# EAGLE schematic P1 Breakout (EAGLE 9.0.1)
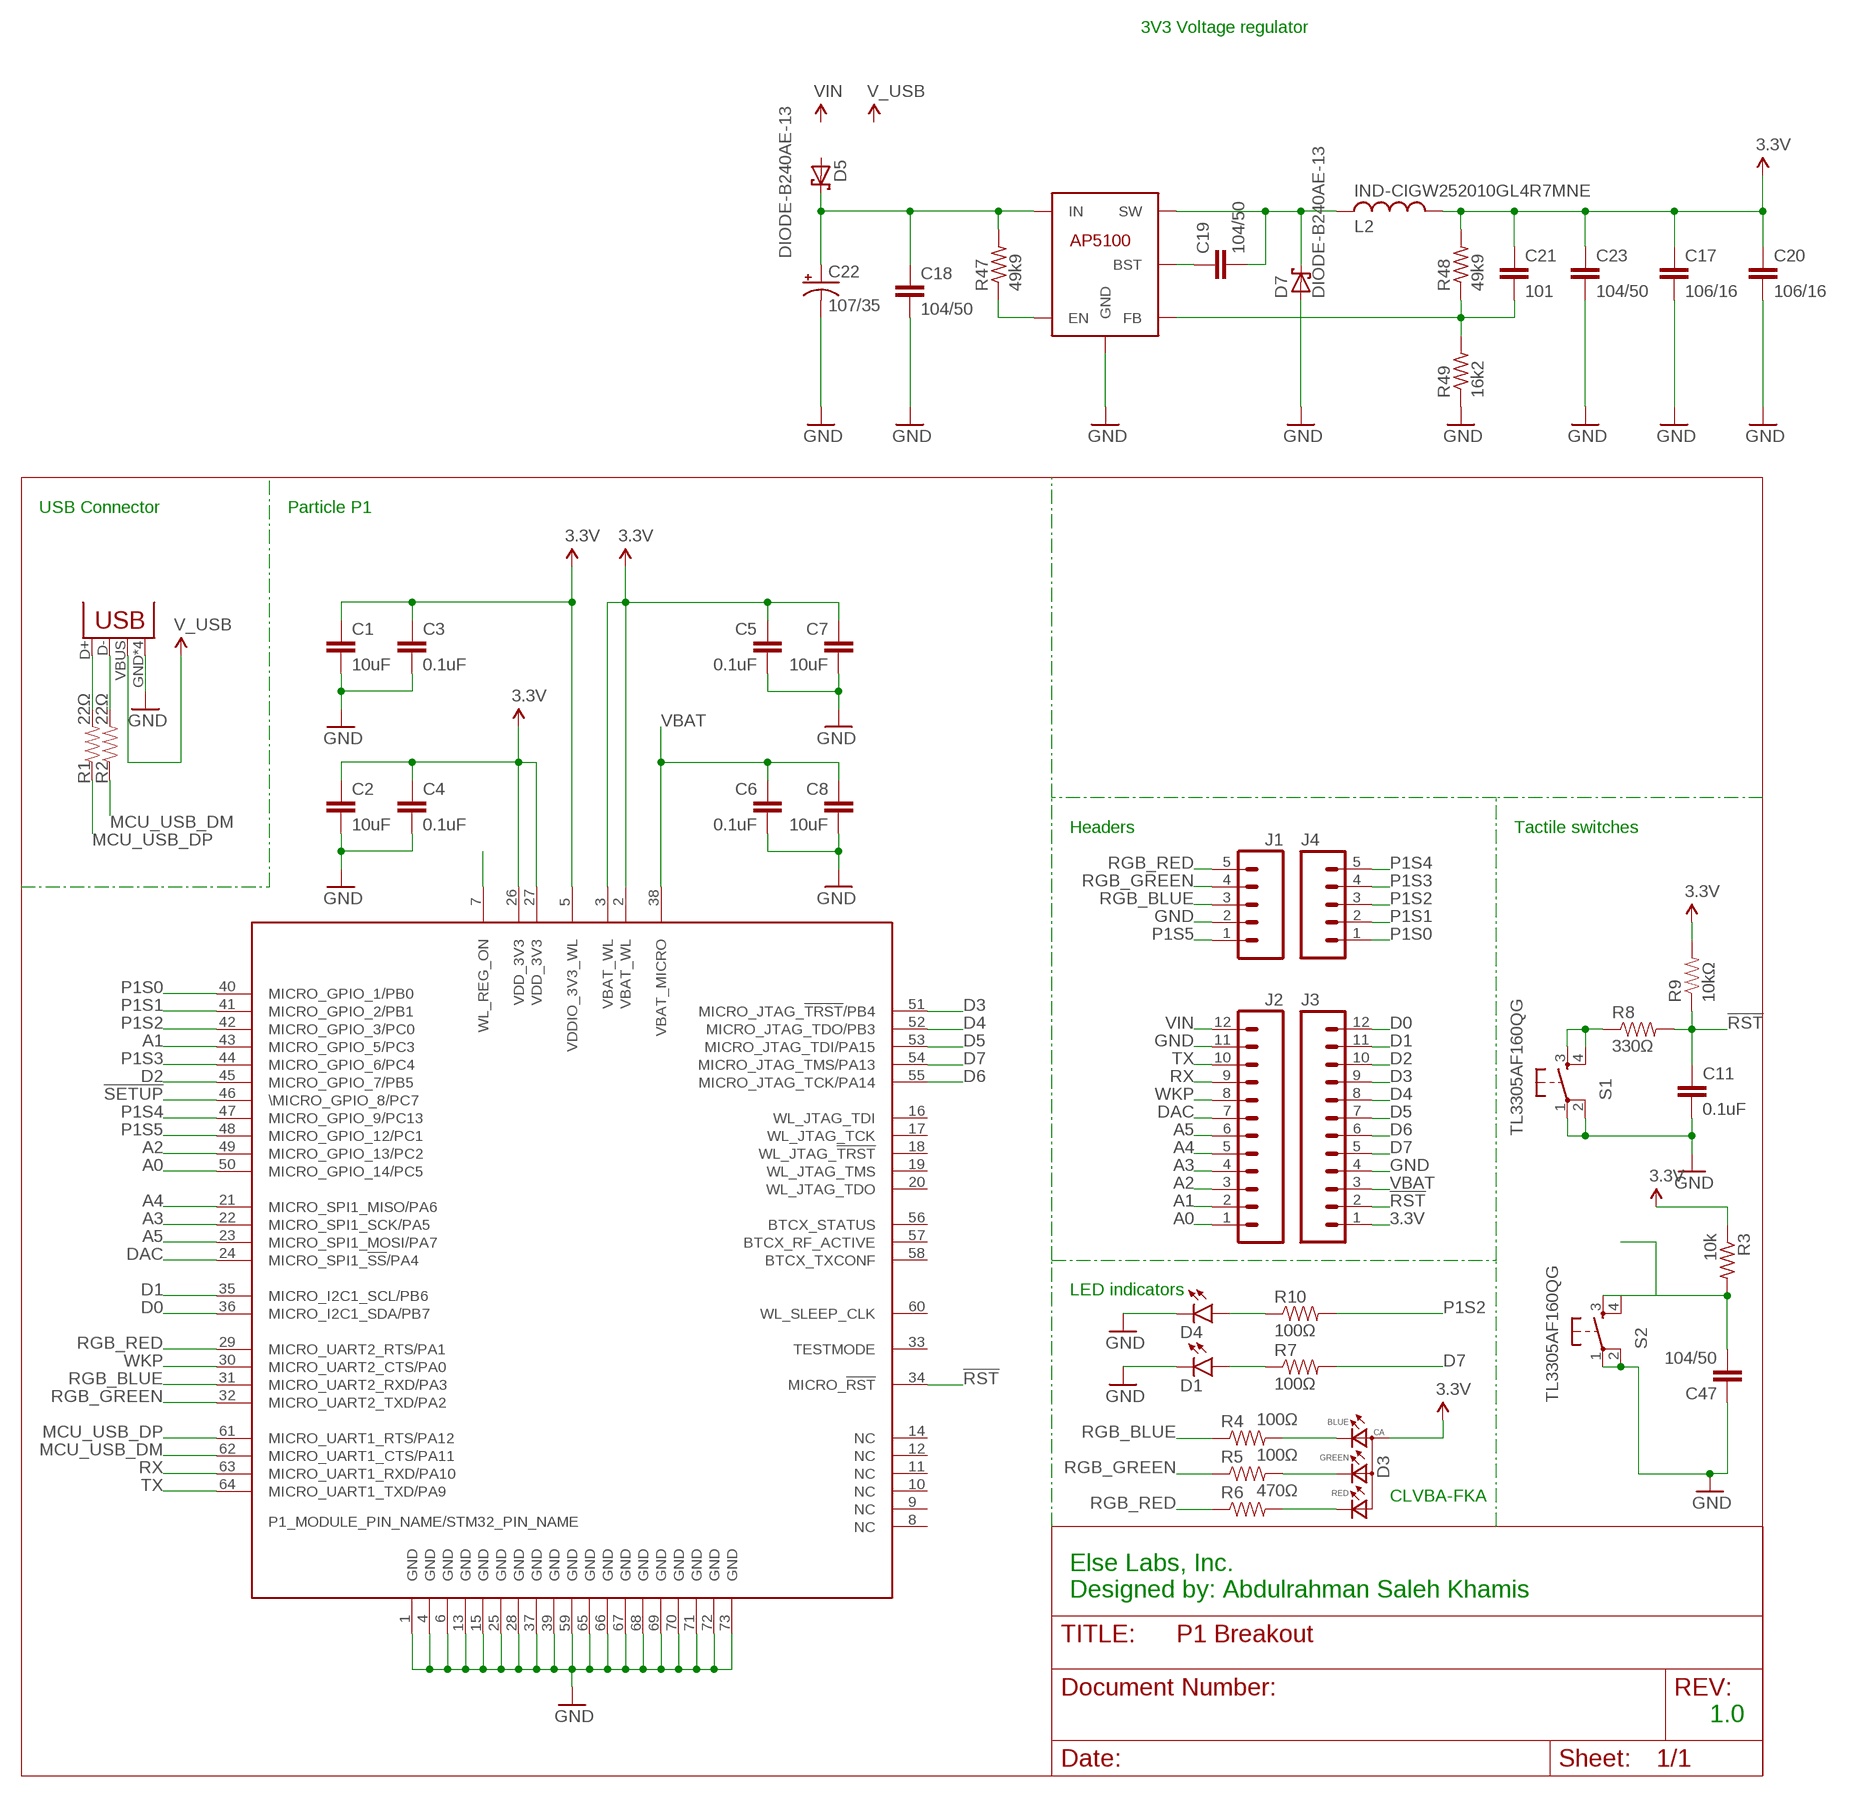
[diagram p0: schematic, sheet 1]

## Parts
C1  10uF  CAP0805  [0805]
C2  10uF  CAP0805  [0805]
C3  0.1uF  CAP0805  [0805]
C4  0.1uF  CAP0805  [0805]
C5  0.1uF  CAP0805  [0805]
C6  0.1uF  CAP0805  [0805]
C7  10uF  CAP0805  [0805]
C8  10uF  CAP0805  [0805]
C11  0.1uF  CAP0805  [0805]
C17  106/16  C-EUC0805  [C0805]
C18  104/50  C-EUC0603  [C0603]
C19  104/50  C-EUC0603  [C0603]
C20  106/16  C-EUC0805  [C0805]
C21  101  C-EUC0603  [C0603]
C22  107/35  CPOL-USUD-6,3X7,7  [UD-6,3X7,7_NICHICON]
C23  104/50  C-EUC0603  [C0603]
C47  104/50  C-EUC0603  [C0603]
D1  LED0603  [LED-0603]
D3  CLVBA-FKAPLCC  [4-PLCC]
D4  LED0603  [LED-0603]
D5  DIODE-B240AE-13  [DO-214AC]
D7  DIODE-B240AE-13  [DO-214AC]
IC5  SMSP-BUCK-AP5100  [SOT23-6]
J1  M05NO_SILK  [1X05_NO_SILK]
J2  M12NO_SILK  [1X12_NO_SILK]
J3  M12NO_SILK  [1X12_NO_SILK]
J4  M05NO_SILK  [1X05_NO_SILK]
JP1  USBUSB-MICROB-SLOT-HOLE  [USB-MICROB-SLOT-HOLE]
L2  IND-CIGW252010GL4R7MNE  [L2520]
R1  22Ω  RESISTOR0805-RES  [0805]
R2  22Ω  RESISTOR0805-RES  [0805]
R3  10k  R-US_R0603  [R0603]
R4  100Ω  RESISTOR0805-RES  [0805]
R5  100Ω  RESISTOR0805-RES  [0805]
R6  470Ω  RESISTOR0805-RES  [0805]
R7  100Ω  RESISTOR0805-RES  [0805]
R8  330Ω  RESISTOR0805-RES  [0805]
R9  10kΩ  RESISTOR0805-RES  [0805]
R10  100Ω  RESISTOR0805-RES  [0805]
R47  49k9  R-US_R0603  [R0603]
R48  49k9  R-US_R0603  [R0603]
R49  16k2  R-US_R0603  [R0603]
S1  TL3305AF160QG  SWITCH-MOMENTARY-4.5MX4.5M  [TACTILE_SWITCH_SMD_4.5X4.5MM]
S2  TL3305AF160QG  SWITCH-MOMENTARY-4.5MX4.5M  [TACTILE_SWITCH_SMD_4.5X4.5MM]
UC1  P1  [WM-N-BM-14]

## Nets
3.3V: C1.1 C2.1 C3.1 C4.1 C5.1 C7.1 C17.1 C20.1 C21.1 C23.1 D3.2(ANODE) J3.1 L2.P$1 R3.1 R9.2 R48.2 UC1.2(VBAT_WL) UC1.3(VBAT_WL) UC1.5(VDDIO_3V3_WL) UC1.26(VDD_3V3) UC1.27(VDD_3V3)
!RST: C11.1 J3.2 R8.2 R9.1 UC1.34(MICRO_!RST!)
!SETUP: UC1.46(\MICRO_GPIO_8/PC7)
A0: J2.1 UC1.50(MICRO_GPIO_14/PC5)
A1: J2.2 UC1.43(MICRO_GPIO_5/PC3)
A2: J2.3 UC1.49(MICRO_GPIO_13/PC2)
A3: J2.4 UC1.22(MICRO_SPI1_SCK/PA5)
A4: J2.5 UC1.21(MICRO_SPI1_MISO/PA6)
A5: J2.6 UC1.23(MICRO_SPI1_MOSI/PA7)
BLR: D3.3(BLUE) R4.2
D0: J3.12 UC1.36(MICRO_I2C1_SDA/PB7)
D1: J3.11 UC1.35(MICRO_I2C1_SCL/PB6)
D2: J3.10 UC1.45(MICRO_GPIO_7/PB5)
D3: J3.9 UC1.51(MICRO_JTAG_!TRST!/PB4)
D4: J3.8 UC1.52(MICRO_JTAG_TDO/PB3)
D5: J3.7 UC1.53(MICRO_JTAG_TDI/PA15)
D6: J3.6 UC1.55(MICRO_JTAG_TCK/PA14)
D7: J3.5 R7.2 UC1.54(MICRO_JTAG_TMS/PA13)
DAC: J2.7 UC1.24(MICRO_SPI1_!SS!/PA4)
GND: C1.2 C2.2 C3.2 C4.2 C5.2 C6.2 C7.2 C8.2 C11.2 C17.2 C18.2 C20.2 C22.- C23.2 C47.1 D1.C D4.C D7.A IC5.2(GND) J1.2 J2.11 J3.4 JP1.GND JP1.P$1(GND) JP1.P$2(GND) JP1.P$3(GND) R49.1 S1.1 S1.2 S2.1 S2.2 UC1.1(GND) UC1.4(GND) UC1.6(GND) UC1.13(GND) UC1.15(GND) UC1.25(GND) UC1.28(GND) UC1.37(GND) UC1.39(GND) UC1.59(GND) UC1.65(GND) UC1.66(GND) UC1.67(GND) UC1.68(GND) UC1.69(GND) UC1.70(GND) UC1.71(GND) UC1.72(GND) UC1.73(GND)
GRR: D3.4(GREEN) R5.2
MCU_USB_DM: R2.1 UC1.62(MICRO_UART1_CTS/PA11)
MCU_USB_DP: R1.1 UC1.61(MICRO_UART1_RTS/PA12)
N$2: JP1.D+ R1.2
N$3: JP1.D- R2.2
N$4: C47.2 R3.2 S2.3
N$6: D1.A R7.1
N$7: R8.1 S1.3 S1.4
N$9: D4.A R10.1
N$15: C18.1 C22.+ D5.C IC5.5(IN) R47.2
N$18: IC5.4(EN) R47.1
N$36: C19.1 IC5.1(BST)
N$37: C19.2 D7.C IC5.6(SW) L2.P$2
N$38: C21.2 IC5.3(FB) R48.1 R49.2
N$43: UC1.7(WL_REG_ON)
P1S0: J4.1 UC1.40(MICRO_GPIO_1/PB0)
P1S1: J4.2 UC1.41(MICRO_GPIO_2/PB1)
P1S2: J4.3 R10.2 UC1.42(MICRO_GPIO_3/PC0)
P1S3: J4.4 UC1.44(MICRO_GPIO_6/PC4)
P1S4: J4.5 UC1.47(MICRO_GPIO_9/PC13)
P1S5: J1.1 UC1.48(MICRO_GPIO_12/PC1)
RER: D3.1(RED) R6.2
RGB_BLUE: J1.3 R4.1 UC1.31(MICRO_UART2_RXD/PA3)
RGB_GREEN: J1.4 R5.1 UC1.32(MICRO_UART2_TXD/PA2)
RGB_RED: J1.5 R6.1 UC1.29(MICRO_UART2_RTS/PA1)
RX: J2.9 UC1.63(MICRO_UART1_RXD/PA10)
TX: J2.10 UC1.64(MICRO_UART1_TXD/PA9)
V_USB: JP1.VBUS
VBAT: C6.1 C8.1 J3.3 UC1.38(VBAT_MICRO)
VIN: J2.12
WKP: J2.8 UC1.30(MICRO_UART2_CTS/PA0)
Unconnected: D5.A S2.4 UC1.8(NC) UC1.9(NC) UC1.10(NC) UC1.11(NC) UC1.12(NC) UC1.14(NC) UC1.16(WL_JTAG_TDI) UC1.17(WL_JTAG_TCK) UC1.18(WL_JTAG_!TRST!) UC1.19(WL_JTAG_TMS) UC1.20(WL_JTAG_TDO) UC1.33(TESTMODE) UC1.56(BTCX_STATUS) UC1.57(BTCX_RF_ACTIVE) UC1.58(BTCX_TXCONF) UC1.60(WL_SLEEP_CLK)

## Notes on the sheet
- 3V3 Voltage regulator
- USB Connector | Particle P1
- Headers | Tactile switches
- LED indicators
- CLVBA-FKA
- Else Labs, Inc.
  Designed by: Abdulrahman Saleh Khamis
- 1.0

## Library data of the parts
C1-C8 C11 = SparkFun-Capacitors:CAP: Capacitor Standard 0603 ceramic capacitor, and 0.1" leaded capacitor.
C17-C21 C23 C47 = rcl:C-EU: CAPACITOR, European symbol; SPICEPREFIX: C
C22 = rcl:CPOL-US: POLARIZED CAPACITOR, American symbol; SPICEPREFIX: C
D1 D4 = SparkFun-LED:LED: LEDs Standard schematic elements and footprints for 5mm, 3mm, 1206, and 0603 sized LEDs. 5mm - Spark Fun Electronics SKU : COM-00529 (and others)
D3 = ElseLabs:CLVBA-FKA: Everlight Red/Green/Blue LED 67-23/R6GHBHC-B01/2T || 67-23/R6GHBH-B01 Size 3.2*2.8*1.9mm Mounting Type SMD Full-Color LED PLCC4 Emitting Color Red/Green/Blue (620-625/530-535/470-475 nm) Chip Material AlGaInP/InGaN/InGaN Luminous Intensity 57-112/225-450/36-72 mcd Viewing Angle 120 deg Lens Type-Color Water Clear Forward Voltage 2.0/3.5/3.5 V Forward Current 10 mA Maximum Forward Voltage 2.4/3.9/3.9 V Maximum Forward Current 25/25/25 mA Min-Max Operating Temperature -40C to +85C Factory Pack 2000 pcs-Reel RoHS ✓; PROD_ID: DIO-12986
D5 D7 = TAHI EagleCAD part library:DIODE-B240AE-13
IC5 = TAHI EagleCAD part library:SMSP-BUCK-AP5100
J1 J4 = SparkFun-Connectors:M05: Header 5 Standard 5-pin 0.1" header. Use with straight break away headers (SKU : PRT-00116), right angle break away headers (PRT-00553), swiss pins (PRT-00743), machine pins (PRT-00117), and female headers (PRT-00115). Molex polarized connector foot print use with SKU : PRT-08230 with associated crimp pins and housings.
J2 J3 = SparkFun-Connectors:M12: Header 12 Standard 12-pin 0.1" header. Use with straight break away headers (SKU : PRT-00116), right angle break away headers (PRT-00553), swiss pins (PRT-00743), machine pins (PRT-00117), and female headers (PRT-00115).
JP1 = ElseLabs:USB
L2 = TAHI EagleCAD part library:IND-CIGW252010GL4R7MNE
R1 R2 R4-R10 = SparkFun-Resistors:RESISTOR: Resistor Basic schematic elements and footprints for 0603, 1206, and PTH resistors.
R3 R47-R49 = rcl:R-US_: RESISTOR, American symbol; SPICEPREFIX: R
S1 S2 = ElseLabs:SWITCH-MOMENTARY
UC1 = Particle-Devices:P1: Particle P1 module (WiFi with antenna)